# Altium schematic sheet lb-charDisp-SMPS5V.SchDoc
size A4
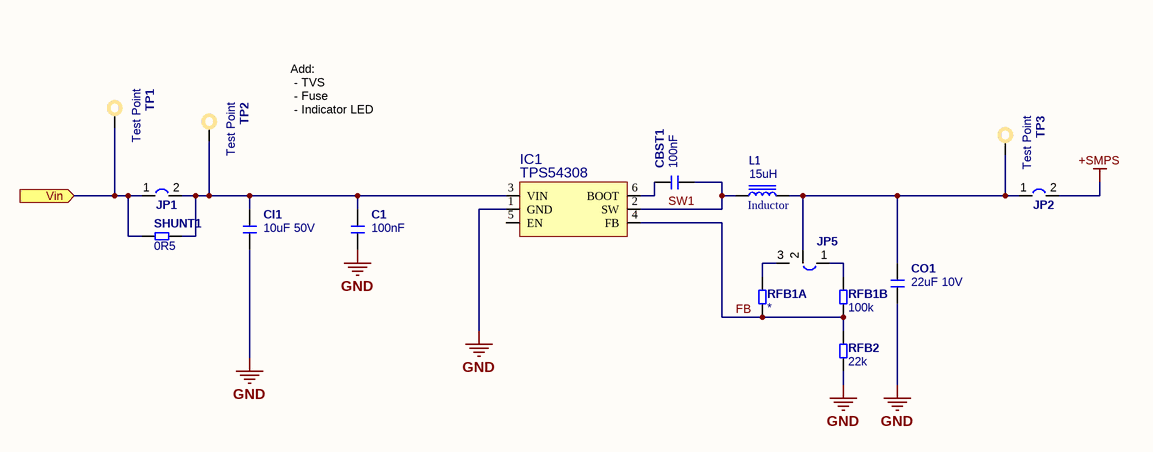
[diagram p0: lb-charDisp-SMPS5V.SchDoc]

## Parts
C1  100nF  [C0603_N]
CBST1  100nF  [C0603_N]
CI1  10uF 50V  [C1210_N]
CO1  22uF 10V  [C1210_N]
IC1  TPS54308  [SOT23]
JP1  Jumper 2W  [Jumper SMD 2W NO]  (value not drawn)
JP2  Jumper 2W  [Jumper SMD 2W NO]  (value not drawn)
JP5  Jumper 3W  [Jumper SMD 3W NO]  (value not drawn)
L1  Inductor  value 15uH  [Inductor 4mm]
RFB1A  *  [R0603]
RFB1B  100k  [R0603]
RFB2  22k  [R0603]
SHUNT1  0R5  [R0603]
TP1  Test Point  [TestPoint-1.2mm]
TP2  Test Point  [TestPoint-1.2mm]
TP3  Test Point  [TestPoint-1.2mm]

## Ports
Vin (in)

## Nets
+SMPS: JP2.2
GND: C1.2 CI1.2 CO1.2 IC1.1(GND) RFB2.1
FB: IC1.4(FB) RFB1A.1 RFB1B.1 RFB2.2
SW1: CBST1.2 IC1.2(SW) L1.1
Vin: JP1.1 SHUNT1.1 TP1.1 ; port Vin
NetC1_1: C1.1 CI1.1 IC1.3(VIN) JP1.2 SHUNT1.2 TP2.1
NetCBST1_1: CBST1.1 IC1.6(BOOT)
NetCO1_1: CO1.1 JP2.1 JP5.2 L1.2 TP3.1
NetJP5_1: JP5.1 RFB1B.2
NetJP5_3: JP5.3 RFB1A.2

Not connected (* = marked no-connect by the designer): IC1 5(EN)

## Notes on the sheet
- Add:
  - TVS
  - Fuse
  - Indicator LED

## Library data of the parts
C1 CBST1 CI1 CO1 = Capacitor: Capacitor MLCC; Manufacturer: Yageo; Manufacturer Part Number: CC0603KRX7R9BB104; Tolerance (%): 10; Category: Capacitor; Package: 0603; Supplier Part Number 1: 1362556; Supplier 1: Farnell; ComponentLink1URL: http://www.yageo.com; ComponentLink1Description: Manufacturer Website; Voltage Rating (Volts): *; Supplier 2: Digi-Key; Supplier Part Number 2: 311-1344-1-ND
  C1 CBST1: Value: 100nF
  CI1: Value: 10uF 50V
  CO1: Value: 22uF 10V
IC1 = TPS54308: Buck Converter
RFB1A RFB1B RFB2 SHUNT1 = Resistor: Published: 17-Dec-2003; LatestRevisionDate: 19-Mar-2004; LatestRevisionNote: Silkscreen size reduced.; PackageDocument: Mar-2003; PackageReference: 3-0603; Publisher: Altium Limited; Code_IPC: 1608 [0603]; ComponentLink1Description: Manufacturer Link; ComponentLink1URL: http://www.panasonic.com/industrial/components/resistive_products.htm; ComponentLink2Description: Datasheet; ComponentLink2URL: http://www.panasonic.com/industrial/components/pdf/AOA0000CE2.pdf
  RFB1A: Value: *
  RFB1B: Value: 100k
  RFB2: Value: 22k
  SHUNT1: Value: 0R5